# Altium schematic sheet UPS.SchDoc (part 4 of 4)
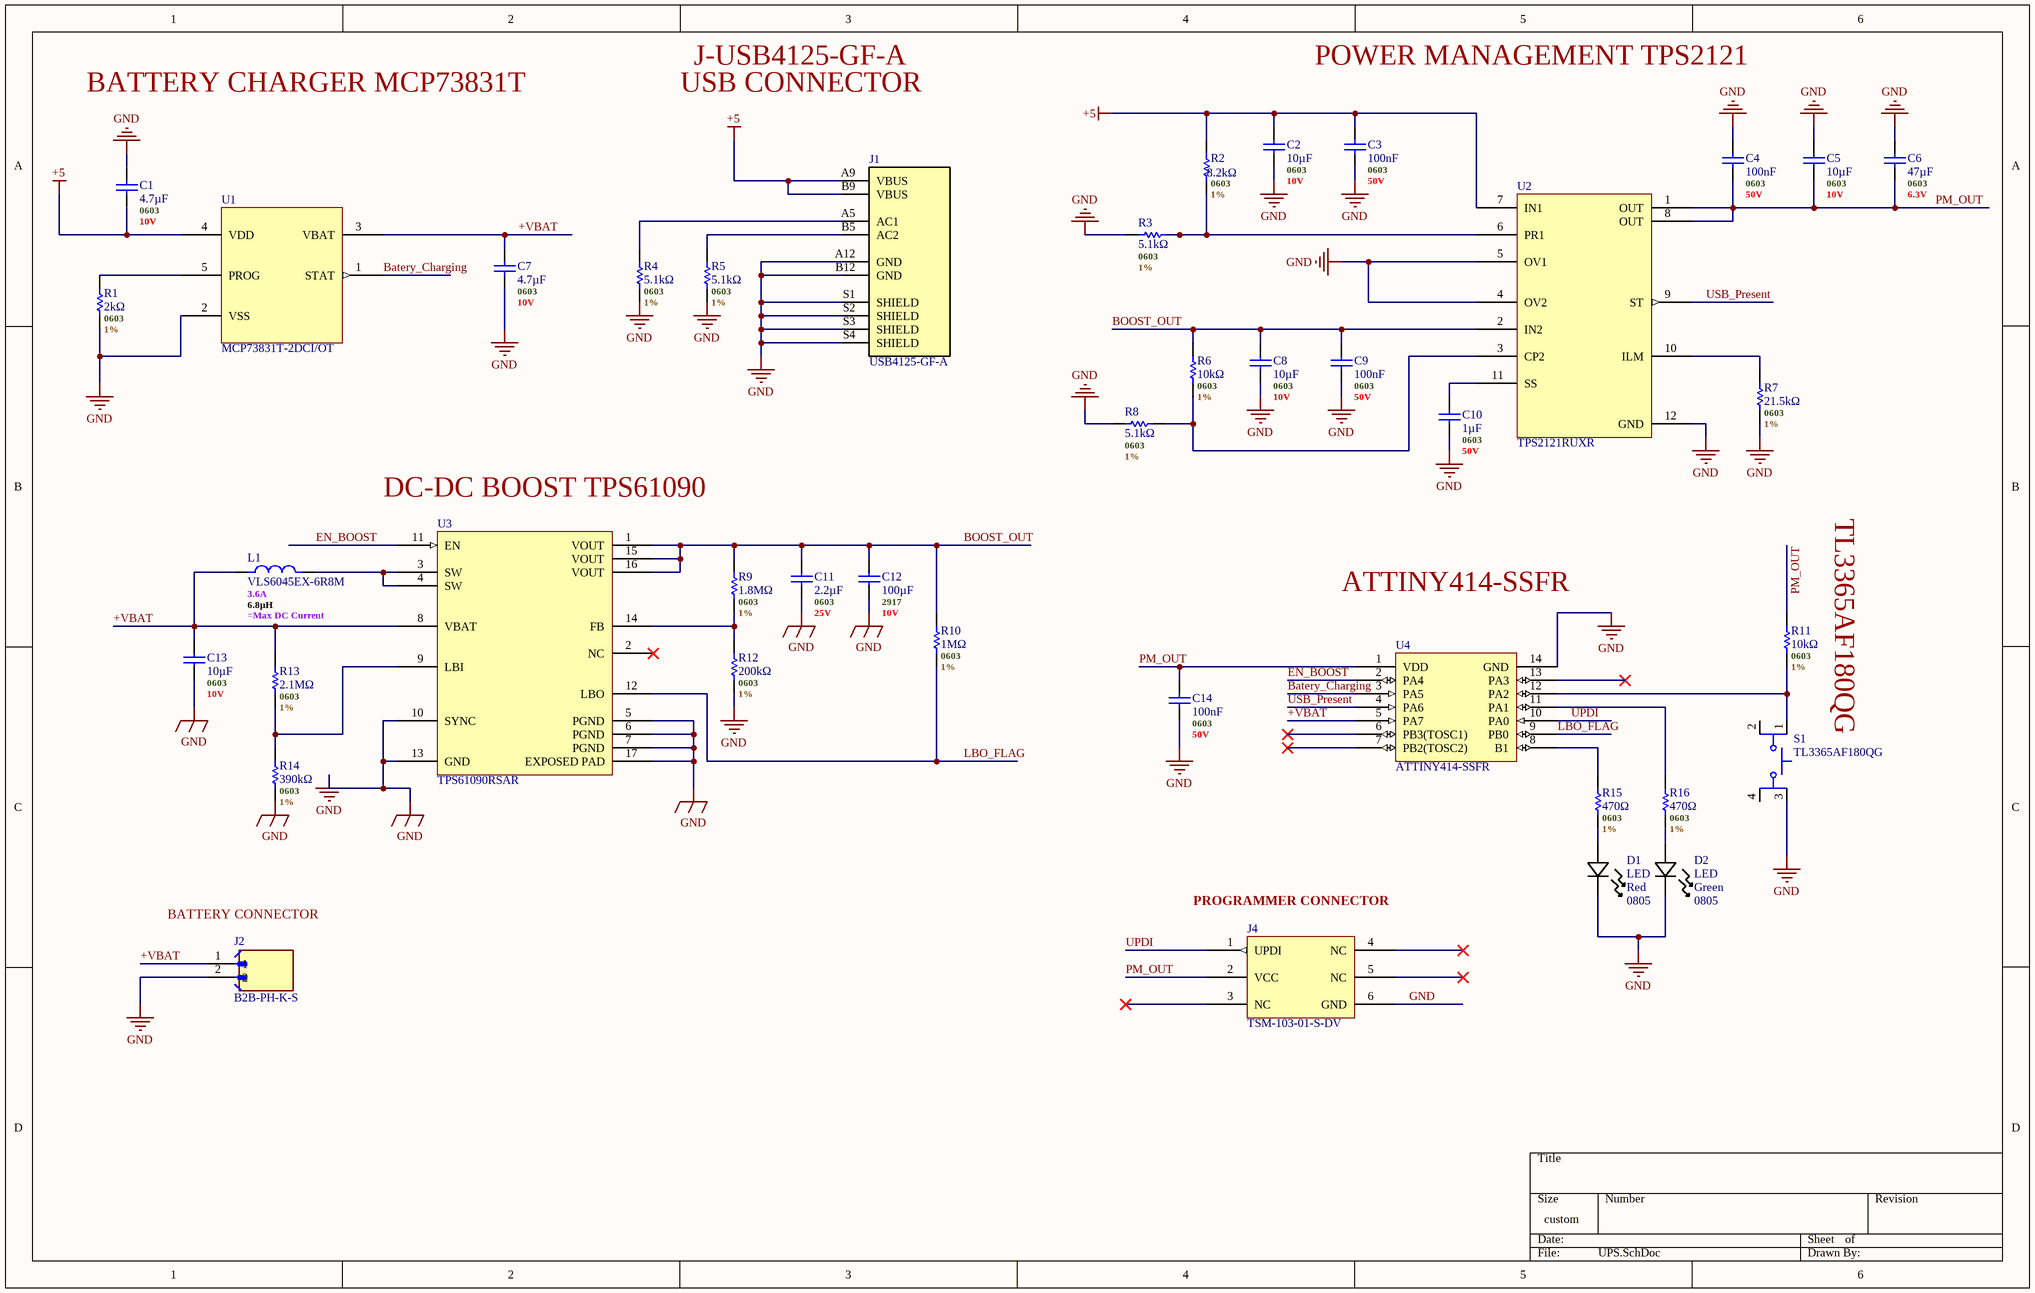
[diagram p3: UPS.SchDoc]

## Library data of the parts (continued)
R14 = RESISTOR - GENERIC: Res Thick Film 0603 390K Ohm 1% 0.1W(1/10W) ±100ppm/C Pad SMD T/R; Manufacturer: Yageo Group; Manufacturer Part Number: RC0603FR-07390KL; Max Power Dissipation: 100mW; Temperature Coefficient: 100ppm/°C; Voltage Rating: 75V; Voltage Rating (AC): 50V; Supplier: DigiKey; Supplier Part Number: 311-390KHRCT-ND; RoHS: Compliant; Category: Chip SMD Resistors; Stock: 23907; Pricing: 1=0,1, 10=0,007, 25=0,0068, 50=0,0062, 100=0,0051 (USD); Case/Package: 0603; Case Code (Imperial): 0603; China RoHS: Non-Compliant; Composition: Thick Film; Depth: 800µm; Features: Moisture Resistant; Height: 450µm; Lead Free: Lead Free; Length: 1.6mm; Lifecycle Status: Production; Max Operating Temperature: 155°C; Military Standard: Not; Min Operating Temperature: -55°C; Mounting Technology: Surface Mount; Pins: 2; Number of Terminals: 2; Number of Terminations: 2; Power Dissipation: 100mW; Power Rating: 100mW; REACH SVHC: Yes; Value: 390kΩ; Schedule B: 8533210045, 8533210045|8533210045, 8533210045|8533210045|8533210045, 8533210045|8533210045|8533210045|8533210045; Termination: SMD/SMT; Tolerance: 1%; Voltage Rating (DC): 50V; Width: 800µm; Working Voltage: 75V; ComponentLink1URL: https://datasheet.octopart.com:443/RC0603FR-07390KL-Yageo-datasheet-175887523.pdf?src-supplier=IHS; ComponentLink1Description: https://datasheet.octopart.com:443/RC0603FR-07390KL-Yageo-datasheet-175887523.pdf?src-supplier=IHS; ComponentLink2URL: https://datasheet.octopart.com:443/RC0603FR-07390KL-Yageo-datasheet-103092701.pdf?src-supplier=Upverter; ComponentLink2Description: https://datasheet.octopart.com:443/RC0603FR-07390KL-Yageo-datasheet-103092701.pdf?src-supplier=Upverter; ComponentLink3URL: https://datasheet.octopart.com:443/RC0603FR-07390KL-Yageo-datasheet-8328172.pdf?src-supplier=Newark; ComponentLink3Description: https://datasheet.octopart.com:443/RC0603FR-07390KL-Yageo-datasheet-8328172.pdf?src-supplier=Newark; ComponentLink4URL: https://datasheet.octopart.com:443/RC0603FR-07390KL-Yageo-datasheet-62067350.pdf?src-supplier=Newark; ComponentLink4Description: https://datasheet.octopart.com:443/RC0603FR-07390KL-Yageo-datasheet-62067350.pdf?src-supplier=Newark; ComponentLink5URL: https://datasheet.octopart.com:443/RC0603FR-07390KL-Yageo-datasheet-164759695.pdf?src-supplier=Future+Electronics; ComponentLink5Description: https://datasheet.octopart.com:443/RC0603FR-07390KL-Yageo-datasheet-164759695.pdf?src-supplier=Future+Electronics; ComponentLink6URL: https://datasheet.octopart.com:443/RC0603FR-07390KL-Yageo-datasheet-137700087.pdf?src-supplier=Future+Electronics; ComponentLink6Description: https://datasheet.octopart.com:443/RC0603FR-07390KL-Yageo-datasheet-137700087.pdf?src-supplier=Future+Electronics; ComponentLink7URL: https://datasheet.octopart.com:443/RC0603FR-07390KL-Yageo-datasheet-127823281.pdf?src-supplier=Future+Electronics; ComponentLink7Description: https://datasheet.octopart.com:443/RC0603FR-07390KL-Yageo-datasheet-127823281.pdf?src-supplier=Future+Electronics; ComponentLink8URL: https://datasheet.octopart.com:443/RC0603FR-07390KL-Yageo-datasheet-27584510.pdf?src-supplier=Future+Electronics; ComponentLink8Description: https://datasheet.octopart.com:443/RC0603FR-07390KL-Yageo-datasheet-27584510.pdf?src-supplier=Future+Electronics; ComponentLink9URL: https://datasheet.octopart.com:443/RC0603FR-07390KL-Yageo-datasheet-15599030.pdf?src-supplier=Future+Electronics; ComponentLink9Description: https://datasheet.octopart.com:443/RC0603FR-07390KL-Yageo-datasheet-15599030.pdf?src-supplier=Future+Electronics; ComponentLink10URL: https://datasheet.octopart.com:443/RC0603FR-07390KL-Yageo-datasheet-12596169.pdf?src-supplier=Future+Electronics; ComponentLink10Description: https://datasheet.octopart.com:443/RC0603FR-07390KL-Yageo-datasheet-12596169.pdf?src-supplier=Future+Electronics; ComponentLink11URL: https://datasheet.octopart.com:443/RC0603FR-07390KL-Yageo-datasheet-148775077.pdf?src-supplier=TME; ComponentLink11Description: https://datasheet.octopart.com:443/RC0603FR-07390KL-Yageo-datasheet-148775077.pdf?src-supplier=TME; ComponentLink12URL: https://datasheet.octopart.com/RC0603FR-07390KL-Yageo-datasheet-73766026.pdf; ComponentLink12Description: https://datasheet.octopart.com/RC0603FR-07390KL-Yageo-datasheet-73766026.pdf; ComponentLink13URL: https://datasheet.octopart.com:443/RC0603FR-07390KL-Yageo-datasheet-118562.pdf?src-supplier=DigiKey; ComponentLink13Description: https://datasheet.octopart.com:443/RC0603FR-07390KL-Yageo-datasheet-118562.pdf?src-supplier=DigiKey; ComponentLink14URL: http://sigma.octopart.com:80/rohs_statement/Yageo-company-2.pdf?src-supplier=Compliance+Statements; ComponentLink14Description: http://sigma.octopart.com:80/rohs_statement/Yageo-company-2.pdf?src-supplier=Compliance+Statements; ComponentLink15URL: http://sigma.octopart.com:80/conflict_mineral_statement/Yageo-company-3.pdf?src-supplier=Compliance+Statements; ComponentLink15Description: http://sigma.octopart.com:80/conflict_mineral_statement/Yageo-company-3.pdf?src-supplier=Compliance+Statements; Supplier 1: DigiKey; Supplier Part Number 1: 311-390KHRCT-ND
R15 R16 = RESISTOR - GENERIC: Fixed Resistor, Thin Film, 0.1W, 470ohm, 75V, 1% +/-Tol, 50ppm/Cel, Surface Mount, 0603; Manufacturer: Yageo Group; Manufacturer Part Number: RT0603FRE07470RL; Power Dissipation: 100mW; Temperature Coefficient: 50ppm/°C; Supplier: DigiKey; Supplier Part Number: YAG5742CT-ND; RoHS: Compliant; Category: Chip SMD Resistors; Stock: 23049; Pricing: 1=0,1, 10=0,010, 25=0,0096, 50=0,0092, 100=0,0087, 250=0,00808, 1000=0,00764 (USD); Case/Package: 0603; Case Code (Imperial): 0603; China RoHS: Non-Compliant; Composition: Thin Film; Depth: 800µm; Height: 450µm; Lead Free: Lead Free; Length: 1.6mm; Lifecycle Status: Production; Max Operating Temperature: 155°C; Military Standard: Not; Min Operating Temperature: -55°C; Mounting Technology: Surface Mount; Pins: 2; Number of Terminals: 2; Power Rating: 100mW; REACH SVHC: Yes; Value: 470Ω; Schedule B: 8533210045, 8533210045|8533210045|8533210045|8533210045|8533210045|8533210045|8533210045|8533210045|8533210045|8533210045|8533210045|8533210045|8533210045|8533210045, 8533210045|8533210045|8533210045|8533210045|8533210045|8533210045|8533210045|8533210045|8533210045|8533210045|8533210045|8533210045|8533210045|8533210045|8533210045, 8533210045|8533210045|8533210045|8533210045|8533210045|8533210045|8533210045|8533210045|8533210045|8533210045|8533210045|8533210045|8533210045|8533210045|8533210045|8533210045; Termination: SMD/SMT; Tolerance: 1%; Voltage Rating: 75V; Voltage Rating (DC): 75V; Width: 800µm; Working Voltage: 75V; ComponentLink1URL: https://datasheet.octopart.com:443/RT0603FRE07470RL-Yageo-datasheet-176402239.pdf?src-supplier=IHS; ComponentLink1Description: https://datasheet.octopart.com:443/RT0603FRE07470RL-Yageo-datasheet-176402239.pdf?src-supplier=IHS; ComponentLink2URL: https://datasheet.octopart.com:443/RT0603FRE07470RL-Yageo-datasheet-96443642.pdf?src-supplier=Upverter; ComponentLink2Description: https://datasheet.octopart.com:443/RT0603FRE07470RL-Yageo-datasheet-96443642.pdf?src-supplier=Upverter; ComponentLink3URL: https://datasheet.octopart.com:443/RT0603FRE07470RL-Yageo-Group-datasheet-188167888.pdf?src-supplier=TME; ComponentLink3Description: https://datasheet.octopart.com:443/RT0603FRE07470RL-Yageo-Group-datasheet-188167888.pdf?src-supplier=TME; ComponentLink4URL: https://datasheet.octopart.com:443/RT0603FRE07470RL-Yageo-datasheet-67645616.pdf?src-supplier=element14+APAC; ComponentLink4Description: https://datasheet.octopart.com:443/RT0603FRE07470RL-Yageo-datasheet-67645616.pdf?src-supplier=element14+APAC; ComponentLink5URL: https://datasheet.octopart.com:443/RT0603FRE07470RL-Yageo-datasheet-10915759.pdf?src-supplier=element14+APAC; ComponentLink5Description: https://datasheet.octopart.com:443/RT0603FRE07470RL-Yageo-datasheet-10915759.pdf?src-supplier=element14+APAC; ComponentLink6URL: https://datasheet.octopart.com:443/RT0603FRE07470RL-Yageo-datasheet-8324589.pdf?src-supplier=Newark; ComponentLink6Description: https://datasheet.octopart.com:443/RT0603FRE07470RL-Yageo-datasheet-8324589.pdf?src-supplier=Newark; ComponentLink7URL: https://datasheet.octopart.com:443/RT0603FRE07470RL-Yageo-datasheet-164439670.pdf?src-supplier=Newark; ComponentLink7Description: https://datasheet.octopart.com:443/RT0603FRE07470RL-Yageo-datasheet-164439670.pdf?src-supplier=Newark; ComponentLink8URL: https://datasheet.octopart.com:443/RT0603FRE07470RL-Yageo-datasheet-169971040.pdf?src-supplier=Future+Electronics; ComponentLink8Description: https://datasheet.octopart.com:443/RT0603FRE07470RL-Yageo-datasheet-169971040.pdf?src-supplier=Future+Electronics; ComponentLink9URL: https://datasheet.octopart.com:443/RT0603FRE07470RL-Yageo-datasheet-166250672.pdf?src-supplier=Future+Electronics; ComponentLink9Description: https://datasheet.octopart.com:443/RT0603FRE07470RL-Yageo-datasheet-166250672.pdf?src-supplier=Future+Electronics; ComponentLink10URL: https://datasheet.octopart.com:443/RT0603FRE07470RL-Yageo-datasheet-137700930.pdf?src-supplier=Future+Electronics; ComponentLink10Description: https://datasheet.octopart.com:443/RT0603FRE07470RL-Yageo-datasheet-137700930.pdf?src-supplier=Future+Electronics; ComponentLink11URL: https://datasheet.octopart.com:443/RT0603FRE07470RL-Yageo-Group-datasheet-141265893.pdf?src-supplier=ODG+(Origin+Data+Global); ComponentLink11Description: https://datasheet.octopart.com:443/RT0603FRE07470RL-Yageo-Group-datasheet-141265893.pdf?src-supplier=ODG+(Origin+Data+Global); ComponentLink12URL: https://datasheet.octopart.com/RT0603FRE07470RL-Yageo-datasheet-86813807.pdf; ComponentLink12Description: https://datasheet.octopart.com/RT0603FRE07470RL-Yageo-datasheet-86813807.pdf; ComponentLink13URL: http://sigma.octopart.com:80/rohs_statement/Yageo-company-2.pdf?src-supplier=Compliance+Statements; ComponentLink13Description: http://sigma.octopart.com:80/rohs_statement/Yageo-company-2.pdf?src-supplier=Compliance+Statements; ComponentLink14URL: http://sigma.octopart.com:80/conflict_mineral_statement/Yageo-company-3.pdf?src-supplier=Compliance+Statements; ComponentLink14Description: http://sigma.octopart.com:80/conflict_mineral_statement/Yageo-company-3.pdf?src-supplier=Compliance+Statements; Supplier 1: DigiKey; Supplier Part Number 1: YAG5742CT-ND
S1 = TL3365AF180QG: Switch Tactile N.O. SPST Button Gull Wing 0.05A 12VDC 100000Cycles 1.77N SMD; MF: E-Switch; Contact Resistance: 100mΩ; Electrical Life: 100kcycles; Illumination Type: Non-Illuminated; Max Current Rating: 50mA; Max Voltage Rating (DC): 12V; Number of Positions: 1; Operating Force: 1.76N; Switch Function: Off-Mom; Switch Travel: 200µm; SnapEDA_Link: https://www.snapeda.com/parts/TL3365AF180QG/E-Switch/view-part/?ref=snap; Package: None; Value: *; MP: TL3365AF180QG; Check_prices: https://www.snapeda.com/parts/TL3365AF180QG/E-Switch/view-part/?ref=eda; Supplier: DigiKey; Supplier Part Number: EG5384CT-ND; Manufacturer: E-Switch; Manufacturer Part Number: TL3365AF180QG; RoHS: Compliant; Category: Tactile Switches; Stock: 31658; Pricing: 1=0,21, 10=0,181, 25=0,1696, 100=0,1522, 250=0,1412, 500=0,13324, 1000=0,12576 (USD); Contact Material: Silver; Height: 1.55mm; Insulation Resistance: 100MΩ; Lead Free: Lead Free; Length: 4.2mm; Lifecycle Status: Production; Max Operating Temperature: 70°C; Mechanical Life: 100kcycles; Min Operating Temperature: -20°C; Mounting Technology: Surface Mount; REACH SVHC: Yes; Termination: Gull Wing; Throw Configuration: SPST; ComponentLink1URL: https://datasheet.octopart.com:443/TL3365AF180QG-E-Switch-datasheet-182203474.pdf?src-supplier=IHS; ComponentLink1Description: https://datasheet.octopart.com:443/TL3365AF180QG-E-Switch-datasheet-182203474.pdf?src-supplier=IHS; ComponentLink2URL: https://datasheet.octopart.com:443/TL3365AF180QG-E-Switch-datasheet-188936971.pdf?src-supplier=TME; ComponentLink2Description: https://datasheet.octopart.com:443/TL3365AF180QG-E-Switch-datasheet-188936971.pdf?src-supplier=TME; ComponentLink3URL: https://datasheet.octopart.com:443/TL3365AF180QG-E-Switch-datasheet-62330653.pdf?src-supplier=Electro+Sonic; ComponentLink3Description: https://datasheet.octopart.com:443/TL3365AF180QG-E-Switch-datasheet-62330653.pdf?src-supplier=Electro+Sonic; ComponentLink4URL: https://datasheet.octopart.com:443/TL3365AF180QG-E-Switch-datasheet-181955371.pdf?src-supplier=Farnell; ComponentLink4Description: https://datasheet.octopart.com:443/TL3365AF180QG-E-Switch-datasheet-181955371.pdf?src-supplier=Farnell; ComponentLink5URL: https://datasheet.octopart.com:443/TL3365AF180QG-E-Switch-datasheet-62330039.pdf?src-supplier=Newark; ComponentLink5Description: https://datasheet.octopart.com:443/TL3365AF180QG-E-Switch-datasheet-62330039.pdf?src-supplier=Newark; ComponentLink6URL: https://datasheet.octopart.com:443/TL3365AF180QG-E-Switch-datasheet-155697103.pdf?src-supplier=RS+(Formerly+Allied+Electronics); ComponentLink6Description: https://datasheet.octopart.com:443/TL3365AF180QG-E-Switch-datasheet-155697103.pdf?src-supplier=RS+(Formerly+Allied+Electronics); Supplier 1: DigiKey; Supplier Part Number 1: EG5384CT-ND
U1 = MCP73831T-2DCI/OT: Linear Battery Charger Controller Li-Ion/Li-Pol 505mA 4.2V 5-Pin SOT-23 T/R; Manufacturer: Microchip; Max Charge Current: 500mA; Max Supply Voltage: 3.75V; Max Junction Temperature (Tj): 125°C; Max Output Voltage: 4.232V; Min Output Voltage: 4.168V; Nominal Supply Voltage: 6V; Number of Cells: 1; Operating Supply Current: 510µA; Supplier: DigiKey; Supplier Part Number: MCP73831T-2DCI/OTCT-ND; Manufacturer Part Number: MCP73831T-2DCI/OT; RoHS: Compliant; Category: Battery Management; Stock: 7422; Pricing: 1=0,76, 25=0,63, 100=0,6125 (USD); Projected EOL Date: 2034-11-03; Ambient Temperature Range High: 85°C; Case/Package: SOT-23-5; Contact Plating: Tin; Country of Assembly: Thailand; Country of Fabrication: United States of America; Country of Origin: Thailand; Export Control Classification Number (ECCN) Code: EAR99; Height: 1.45mm; Harmonized Tariff Schedule (HTS) Code: 8542.39.0060; Introduction Date: 2005-11-03; Length: 3.1mm; Lifecycle Status: Production; Max Operating Temperature: 85°C; Max Output current: 500mA; Min Operating Temperature: -40°C; Min Supply Voltage: 3.75V; Mounting Technology: Surface Mount; Number of Channels: 1; Number of Outputs: 1; Pins: 5; Output Current: 500mA; Output Voltage: 4.2V; Radiation Hardening: No; REACH SVHC: No; Schedule B: 8542390000, 8542390000|8542390000|8542390000|8542390000|8542390000; Width: 1.8mm; ComponentLink1URL: https://datasheet.octopart.com:443/MCP73831T-2DCI/OT-Microchip-datasheet-8814540.pdf?src-supplier=Electro+Sonic; ComponentLink1Description: https://datasheet.octopart.com:443/MCP73831T-2DCI/OT-Microchip-datasheet-8814540.pdf?src-supplier=Electro+Sonic; ComponentLink2URL: https://datasheet.octopart.com:443/MCP73831T-2DCI-OT-Microchip-datasheet-16123459.pdf?src-supplier=Upverter; ComponentLink2Description: https://datasheet.octopart.com:443/MCP73831T-2DCI-OT-Microchip-datasheet-16123459.pdf?src-supplier=Upverter; ComponentLink3URL: https://datasheet.octopart.com:443/MCP73831T-2DCI-OT-Microchip-datasheet-34193478.pdf?src-supplier=Farnell; ComponentLink3Description: https://datasheet.octopart.com:443/MCP73831T-2DCI-OT-Microchip-datasheet-34193478.pdf?src-supplier=Farnell; ComponentLink4URL: https://datasheet.octopart.com:443/MCP73831T-2DCI-OT-Microchip-datasheet-145017548.pdf?src-supplier=Microchip; ComponentLink4Description: https://datasheet.octopart.com:443/MCP73831T-2DCI-OT-Microchip-datasheet-145017548.pdf?src-supplier=Microchip; ComponentLink5URL: https://datasheet.octopart.com:443/MCP73831T-2DCI-OT-Microchip-datasheet-16593012.pdf?src-supplier=element14+APAC; ComponentLink5Description: https://datasheet.octopart.com:443/MCP73831T-2DCI-OT-Microchip-datasheet-16593012.pdf?src-supplier=element14+APAC; ComponentLink6URL: https://datasheet.octopart.com:443/MCP73831T-2DCI-OT-Microchip-datasheet-158592061.pdf?src-supplier=SHENGYU+ELECTRONICS; ComponentLink6Description: https://datasheet.octopart.com:443/MCP73831T-2DCI-OT-Microchip-datasheet-158592061.pdf?src-supplier=SHENGYU+ELECTRONICS; ComponentLink7URL: https://datasheet.octopart.com:443/MCP73831T-2DCI/OT-Microchip-datasheet-98419.pdf?src-supplier=Mouser; ComponentLink7Description: https://datasheet.octopart.com:443/MCP73831T-2DCI/OT-Microchip-datasheet-98419.pdf?src-supplier=Mouser; ComponentLink8URL: https://datasheet.octopart.com:443/MCP73831T-2DCI/OT-Microchip-datasheet-39874.pdf?src-supplier=DigiKey; ComponentLink8Description: https://datasheet.octopart.com:443/MCP73831T-2DCI/OT-Microchip-datasheet-39874.pdf?src-supplier=DigiKey; ComponentLink9URL: http://sigma.octopart.com:80/188449423/materials_sheet/Microchip-MCP73831T-2DCI-OT.pdf?src-supplier=Compliance+Statements; ComponentLink9Description: http://sigma.octopart.com:80/188449423/materials_sheet/Microchip-MCP73831T-2DCI-OT.pdf?src-supplier=Compliance+Statements; ComponentLink10URL: http://sigma.octopart.com:80/conflict_mineral_statement/Microchip-company-68.pdf?src-supplier=Compliance+Statements; ComponentLink10Description: http://sigma.octopart.com:80/conflict_mineral_statement/Microchip-company-68.pdf?src-supplier=Compliance+Statements; ComponentLink11URL: http://sigma.octopart.com:80/conflict_mineral_statement/Microchip-company-69.pdf?src-supplier=Compliance+Statements; ComponentLink11Description: http://sigma.octopart.com:80/conflict_mineral_statement/Microchip-company-69.pdf?src-supplier=Compliance+Statements; ComponentLink12URL: http://sigma.octopart.com:80/reach_statement/Microchip-company-70.pdf?src-supplier=Compliance+Statements; ComponentLink12Description: http://sigma.octopart.com:80/reach_statement/Microchip-company-70.pdf?src-supplier=Compliance+Statements; ComponentLink13URL: http://sigma.octopart.com:80/rohs_statement/Microchip-company-71.pdf?src-supplier=Compliance+Statements; ComponentLink13Description: http://sigma.octopart.com:80/rohs_statement/Microchip-company-71.pdf?src-supplier=Compliance+Statements; Supplier 1: DigiKey; Supplier Part Number 1: MCP73831T-2DCI/OTCT-ND
U2 = TPS2121RUXR: 2.7-V to 22-V, 56-mΩ, 4.5-A, power mux with seamless switchover 12-VQFN-HR -40 to 125; Manufacturer: Texas Instruments; Manufacturer Lifecycle Status: ACTIVE; Max Junction Temperature (Tj): 125°C; Max Supply Voltage: 22V; Min Supply Voltage: 2.8V; Nominal Supply Current: 300µA; Number of Outputs: 1; Supplier: DigiKey; Supplier Part Number: 296-53410-1-ND; Manufacturer Part Number: TPS2121RUXR; RoHS: Compliant; Category: Power Management ICs; Stock: 9752; Pricing: 1=2,37, 10=1,76, 25=1,6072, 100=1,4391, 250=1,35892, 500=1,31058, 1000=1,27078 (USD); Height: 1mm; Length: 2.5mm; Lifecycle Status: Production; Max Operating Temperature: 125°C; Min Operating Temperature: -40°C; Pins: 12; Output Voltage: 22V; Schedule B: 8542390000, 8542390000|8542390000|8542390000|8542390000|8542390000; Thickness: 900µm; Width: 2mm; ComponentLink1URL: https://octopart.com:443/opatz8j6/c1?t=u__eRulNICzvJgw_uF5jZE4VewBqqVxAEhH6a5865kfiBS97munyJHNwR89MOISaNIlCSIK0p6tyYn4vgEUwA00NusdUrfnqEnnmQHin85Zj7Xz-CnabDGGSIMRYEyZQyUZ9_1lQhHv-e10ijzu5Fv9_tN07M4ouzl3dHDLjVRc4zqqNSbdG7ZpopHa8efgiYSe1iOCqV1SOo3tsaJDthmCWARnaKZ9V2q5WV2HmYoAlkLRJzefOURIjiIua_VTxhiCJdWFvuMhq2aqOyeKhwV9xg5H8ABnwy4ffoCjAbE9kSmNx4Gy2EKE46MjxT9GaZ6IXNuY9WZuTkrZzflCjnBM8kCWZn_jdciZqHXwHUUgC-0cOcFywywnpHLiGbymgn1lU5mc&src-supplier=Texas+Instruments; ComponentLink1Description: https://octopart.com:443/opatz8j6/c1?t=u__eRulNICzvJgw_uF5jZE4VewBqqVxAEhH6a5865kfiBS97munyJHNwR89MOISaNIlCSIK0p6tyYn4vgEUwA00NusdUrfnqEnnmQHin85Zj7Xz-CnabDGGSIMRYEyZQyUZ9_1lQhHv-e10ijzu5Fv9_tN07M4ouzl3dHDLjVRc4zqqNSbdG7ZpopHa8efgiYSe1iOCqV1SOo3tsaJDthmCWARnaKZ9V2q5WV2HmYoAlkLRJzefOURIjiIua_VTxhiCJdWFvuMhq2aqOyeKhwV9xg5H8ABnwy4ffoCjAbE9kSmNx4Gy2EKE46MjxT9GaZ6IXNuY9WZuTkrZzflCjnBM8kCWZn_jdciZqHXwHUUgC-0cOcFywywnpHLiGbymgn1lU5mc&src-supplier=Texas+Instruments; ComponentLink2URL: http://sigma.octopart.com:80/conflict_mineral_statement/Texas-Instruments-company-63.pdf?src-supplier=Compliance+Statements; ComponentLink2Description: http://sigma.octopart.com:80/conflict_mineral_statement/Texas-Instruments-company-63.pdf?src-supplier=Compliance+Statements; ComponentLink3URL: http://sigma.octopart.com:80/reach_statement/Texas-Instruments-company-64.pdf?src-supplier=Compliance+Statements; ComponentLink3Description: http://sigma.octopart.com:80/reach_statement/Texas-Instruments-company-64.pdf?src-supplier=Compliance+Statements; Supplier 1: DigiKey; Supplier Part Number 1: 296-53410-1-ND
U3 = TPS61090RSAR: Conv DC-DC 1.8V to 5.5V Synchronous Step Up Single-Out 1.8V to 5.5V 0.5A 16-Pin VQFN EP T/R; Manufacturer: Texas Instruments; Manufacturer Lifecycle Status: ACTIVE; Efficiency: 96%; Max Output current: 500mA; Number of Outputs: 1; Output Configuration: Positive; Output Current: 2A; Output Type: Adjustable; Quiescent Current: 20µA; Switching Frequency: 600kHz; Synchronous Rectifier: Yes; Topology: Boost; Supplier: DigiKey; Supplier Part Number: 296-15259-1-ND; Manufacturer Part Number: TPS61090RSAR; RoHS: Compliant; Category: Voltage Regulators - Switching; Stock: 9675; Pricing: 1=2,71, 10=2,022, 25=1,8492, 100=1,6598, 250=1,56936, 500=1,51484, 1000=1,46998 (USD); Case/Package: VQFN; Height: 1mm; Length: 4mm; Lifecycle Status: Production; Max Supply Voltage: 5.5V; Max Operating Temperature: 85°C; Max Output Voltage: 5.5V; Min Input Voltage: 1.8V; Min Operating Temperature: -40°C; Min Output Voltage: 1.8V; Mounting Technology: Surface Mount; Pins: 16; Operating Supply Voltage: 5.5V; Output Voltage: 5.5V; Packaging: Tape & Reel; Radiation Hardening: No; Schedule B: 8542390000; Thickness: 900µm; Weight: 41.503702mg; Width: 4mm; ComponentLink1URL: https://sigma.octopart.com:443/179129134/technical_drawing/Texas-Instruments-TPS61090RSAR.pdf?src-supplier=Texas+Instruments; ComponentLink1Description: https://sigma.octopart.com:443/179129134/technical_drawing/Texas-Instruments-TPS61090RSAR.pdf?src-supplier=Texas+Instruments; ComponentLink2URL: https://octopart.com:443/opatz8j6/c1?t=AcQooj3JlTCfhk3VCQUH-aAEBr0wyTfCDEA-x6NEZ2xxPhV97yYYZYKTTzI7ie9NC3rdJUsYEK6CyX6awGzEEcrHtZ_ArfXYtmPr4gKKxI6Kw8agxWkgC3a2xDsXlg-O0fwghwbpb1suK4tlMeroK7wll2-51HzAXEG_iTs83j7TVMfk2sV4EMpy0PTSYrurZmHHqCG8wItxv2OJGrxcCnvFFnZFhd76piKxGXXAjHyftSJJey1je6ukqBFTD2_84SHs_29Ug4OcTy7-Co2GNmDvY-nPAqSt9tN4wM5hyRbOZfDv3RSxiNHdEGiQsBGArixu2cBpknAywPbL-YnUby8ljK6CPTzRMlcqP5D6VeYBdVJmVC4HGqOiiiiHSo5hvGoQOQ&src-supplier=Texas+Instruments; ComponentLink2Description: https://octopart.com:443/opatz8j6/c1?t=AcQooj3JlTCfhk3VCQUH-aAEBr0wyTfCDEA-x6NEZ2xxPhV97yYYZYKTTzI7ie9NC3rdJUsYEK6CyX6awGzEEcrHtZ_ArfXYtmPr4gKKxI6Kw8agxWkgC3a2xDsXlg-O0fwghwbpb1suK4tlMeroK7wll2-51HzAXEG_iTs83j7TVMfk2sV4EMpy0PTSYrurZmHHqCG8wItxv2OJGrxcCnvFFnZFhd76piKxGXXAjHyftSJJey1je6ukqBFTD2_84SHs_29Ug4OcTy7-Co2GNmDvY-nPAqSt9tN4wM5hyRbOZfDv3RSxiNHdEGiQsBGArixu2cBpknAywPbL-YnUby8ljK6CPTzRMlcqP5D6VeYBdVJmVC4HGqOiiiiHSo5hvGoQOQ&src-supplier=Texas+Instruments; ComponentLink3URL: https://datasheet.octopart.com:443/TPS61090RSAR-Texas-Instruments-datasheet-10258986.pdf?src-supplier=Texas+Instruments; ComponentLink3Description: https://datasheet.octopart.com:443/TPS61090RSAR-Texas-Instruments-datasheet-10258986.pdf?src-supplier=Texas+Instruments; ComponentLink4URL: https://sigma.octopart.com:443/49250404/technical_drawing/Texas-Instruments-TPS61090RSAR.pdf?src-supplier=Texas+Instruments; ComponentLink4Description: https://sigma.octopart.com:443/49250404/technical_drawing/Texas-Instruments-TPS61090RSAR.pdf?src-supplier=Texas+Instruments; ComponentLink5URL: https://datasheet.octopart.com:443/TPS61090RSAR-Texas-Instruments-datasheet-149524.pdf?src-supplier=Texas+Instruments; ComponentLink5Description: https://datasheet.octopart.com:443/TPS61090RSAR-Texas-Instruments-datasheet-149524.pdf?src-supplier=Texas+Instruments; ComponentLink6URL: https://datasheet.octopart.com:443/TPS61090RSAR-Texas-Instruments-datasheet-128166.pdf?src-supplier=Texas+Instruments; ComponentLink6Description: https://datasheet.octopart.com:443/TPS61090RSAR-Texas-Instruments-datasheet-128166.pdf?src-supplier=Texas+Instruments; ComponentLink7URL: https://datasheet.octopart.com:443/TPS61090RSAR-Texas-Instruments-datasheet-34157647.pdf?src-supplier=Newark; ComponentLink7Description: https://datasheet.octopart.com:443/TPS61090RSAR-Texas-Instruments-datasheet-34157647.pdf?src-supplier=Newark; ComponentLink8URL: https://datasheet.octopart.com:443/TPS61090RSAR-Texas-Instruments-datasheet-21222488.pdf?src-supplier=Newark; ComponentLink8Description: https://datasheet.octopart.com:443/TPS61090RSAR-Texas-Instruments-datasheet-21222488.pdf?src-supplier=Newark; ComponentLink9URL: https://datasheet.octopart.com:443/TPS61090RSAR-Texas-Instruments-datasheet-14439414.pdf?src-supplier=Upverter; ComponentLink9Description: https://datasheet.octopart.com:443/TPS61090RSAR-Texas-Instruments-datasheet-14439414.pdf?src-supplier=Upverter; ComponentLink10URL: https://datasheet.octopart.com:443/TPS61090RSAR-Texas-Instruments-datasheet-66807785.pdf?src-supplier=Farnell; ComponentLink10Description: https://datasheet.octopart.com:443/TPS61090RSAR-Texas-Instruments-datasheet-66807785.pdf?src-supplier=Farnell; ComponentLink11URL: https://datasheet.octopart.com:443/TPS61090RSAR-Texas-Instruments-datasheet-14167026.pdf?src-supplier=iiiC; ComponentLink11Description: https://datasheet.octopart.com:443/TPS61090RSAR-Texas-Instruments-datasheet-14167026.pdf?src-supplier=iiiC; ComponentLink12URL: https://datasheet.octopart.com:443/TPS61090RSAR-Texas-Instruments-datasheet-61172.pdf?src-supplier=DigiKey; ComponentLink12Description: https://datasheet.octopart.com:443/TPS61090RSAR-Texas-Instruments-datasheet-61172.pdf?src-supplier=DigiKey; ComponentLink13URL: https://datasheet.octopart.com:443/TPS61090RSAR-Texas-Instruments-datasheet-112952.pdf?src-supplier=Sierra+IC; ComponentLink13Description: https://datasheet.octopart.com:443/TPS61090RSAR-Texas-Instruments-datasheet-112952.pdf?src-supplier=Sierra+IC; ComponentLink14URL: http://sigma.octopart.com:80/conflict_mineral_statement/Texas-Instruments-company-63.pdf?src-supplier=Compliance+Statements; ComponentLink14Description: http://sigma.octopart.com:80/conflict_mineral_statement/Texas-Instruments-company-63.pdf?src-supplier=Compliance+Statements; ComponentLink15URL: http://sigma.octopart.com:80/reach_statement/Texas-Instruments-company-64.pdf?src-supplier=Compliance+Statements; ComponentLink15Description: http://sigma.octopart.com:80/reach_statement/Texas-Instruments-company-64.pdf?src-supplier=Compliance+Statements; Supplier 1: DigiKey; Supplier Part Number 1: 296-15259-1-ND
U4 = ATTINY414-SSFR: MCU 8-Bit ATTINY414 AVR RISC 4KB Flash 2.7V to 5.5V 14-Pin SOIC T/R - Tape and Reel; Manufacturer: Microchip; Data Bus Width: 8b; Frequency: 16MHz; Interface: 2-Wire, I2C, IrDA, SPI, UART, USART; Number of A/D Converters: 1; Number of ADC Channels: 10; Number of I/Os: 12; Number of PWM Channels: 6; Number of Timers/Counters: 3; RAM Size: 256B; Supplier: DigiKey; Supplier Part Number: ATTINY414-SSFRCT-ND; Manufacturer Part Number: ATTINY414-SSFR; RoHS: Compliant; Category: Microcontrollers; Stock: 15503; Pricing: 1=0,71, 25=0,65, 100=0,59 (USD); Projected EOL Date: 2044-09-13; Case/Package: SOIC; Core Architecture: AVR; Country of Assembly: Thailand; Country of Fabrication: Taiwan, United States of America; Country of Origin: Taiwan, Thailand; Export Control Classification Number (ECCN) Code: EAR99; Height: 1.75mm; Harmonized Tariff Schedule (HTS) Code: 8542.31.0015; Lifecycle Status: Production; Max Operating Temperature: 125°C; Max Supply Voltage: 5.5V; Memory Size: 4kB; Memory Format: FLASH; Min Operating Temperature: -40°C; Min Supply Voltage: 2.7V; Number of I2C Channels: 1; Pins: 14; Number of SPI Channels: 1; Number of UART Channels: 1; Packaging: Cut Tape; ComponentLink1URL: https://datasheet.octopart.com:443/ATTINY414-SSFR-Microchip-datasheet-150471216.pdf?src-supplier=Microchip; ComponentLink1Description: https://datasheet.octopart.com:443/ATTINY414-SSFR-Microchip-datasheet-150471216.pdf?src-supplier=Microchip; ComponentLink2URL: https://datasheet.octopart.com:443/ATTINY414-SSFR-Microchip-datasheet-147334551.pdf?src-supplier=Microchip; ComponentLink2Description: https://datasheet.octopart.com:443/ATTINY414-SSFR-Microchip-datasheet-147334551.pdf?src-supplier=Microchip; ComponentLink3URL: https://datasheet.octopart.com:443/ATTINY414-SSFR-Microchip-datasheet-95794647.pdf?src-supplier=SHENGYU+ELECTRONICS; ComponentLink3Description: https://datasheet.octopart.com:443/ATTINY414-SSFR-Microchip-datasheet-95794647.pdf?src-supplier=SHENGYU+ELECTRONICS; ComponentLink4URL: https://datasheet.octopart.com:443/ATTINY414-SSFR-Microchip-datasheet-137472778.pdf?src-supplier=Electro+Sonic; ComponentLink4Description: https://datasheet.octopart.com:443/ATTINY414-SSFR-Microchip-datasheet-137472778.pdf?src-supplier=Electro+Sonic; ComponentLink5URL: https://datasheet.octopart.com:443/ATTINY414-SSFR-Microchip-datasheet-95834867.pdf?src-supplier=Future+Electronics; ComponentLink5Description: https://datasheet.octopart.com:443/ATTINY414-SSFR-Microchip-datasheet-95834867.pdf?src-supplier=Future+Electronics; ComponentLink6URL: https://datasheet.octopart.com:443/ATTINY414-SSFR-Microchip-datasheet-147334554.pdf?src-supplier=Microchip+SCT; ComponentLink6Description: https://datasheet.octopart.com:443/ATTINY414-SSFR-Microchip-datasheet-147334554.pdf?src-supplier=Microchip+SCT; ComponentLink7URL: https://datasheet.octopart.com:443/ATTINY414-SSFR-Microchip-datasheet-92899103.pdf?src-supplier=TME; ComponentLink7Description: https://datasheet.octopart.com:443/ATTINY414-SSFR-Microchip-datasheet-92899103.pdf?src-supplier=TME; ComponentLink8URL: http://sigma.octopart.com:80/188449420/materials_sheet/Microchip-ATTINY414-SSFR.pdf?src-supplier=Compliance+Statements; ComponentLink8Description: http://sigma.octopart.com:80/188449420/materials_sheet/Microchip-ATTINY414-SSFR.pdf?src-supplier=Compliance+Statements; ComponentLink9URL: http://sigma.octopart.com:80/rohs_statement/Microchip-company-71.pdf?src-supplier=Compliance+Statements; ComponentLink9Description: http://sigma.octopart.com:80/rohs_statement/Microchip-company-71.pdf?src-supplier=Compliance+Statements; ComponentLink10URL: http://sigma.octopart.com:80/reach_statement/Microchip-company-70.pdf?src-supplier=Compliance+Statements; ComponentLink10Description: http://sigma.octopart.com:80/reach_statement/Microchip-company-70.pdf?src-supplier=Compliance+Statements; ComponentLink11URL: http://sigma.octopart.com:80/conflict_mineral_statement/Microchip-company-69.pdf?src-supplier=Compliance+Statements; ComponentLink11Description: http://sigma.octopart.com:80/conflict_mineral_statement/Microchip-company-69.pdf?src-supplier=Compliance+Statements; ComponentLink12URL: http://sigma.octopart.com:80/conflict_mineral_statement/Microchip-company-68.pdf?src-supplier=Compliance+Statements; ComponentLink12Description: http://sigma.octopart.com:80/conflict_mineral_statement/Microchip-company-68.pdf?src-supplier=Compliance+Statements; Supplier 1: DigiKey; Supplier Part Number 1: ATTINY414-SSFRCT-ND